# EAGLE schematic ManoMeter (EAGLE 7.7.0)
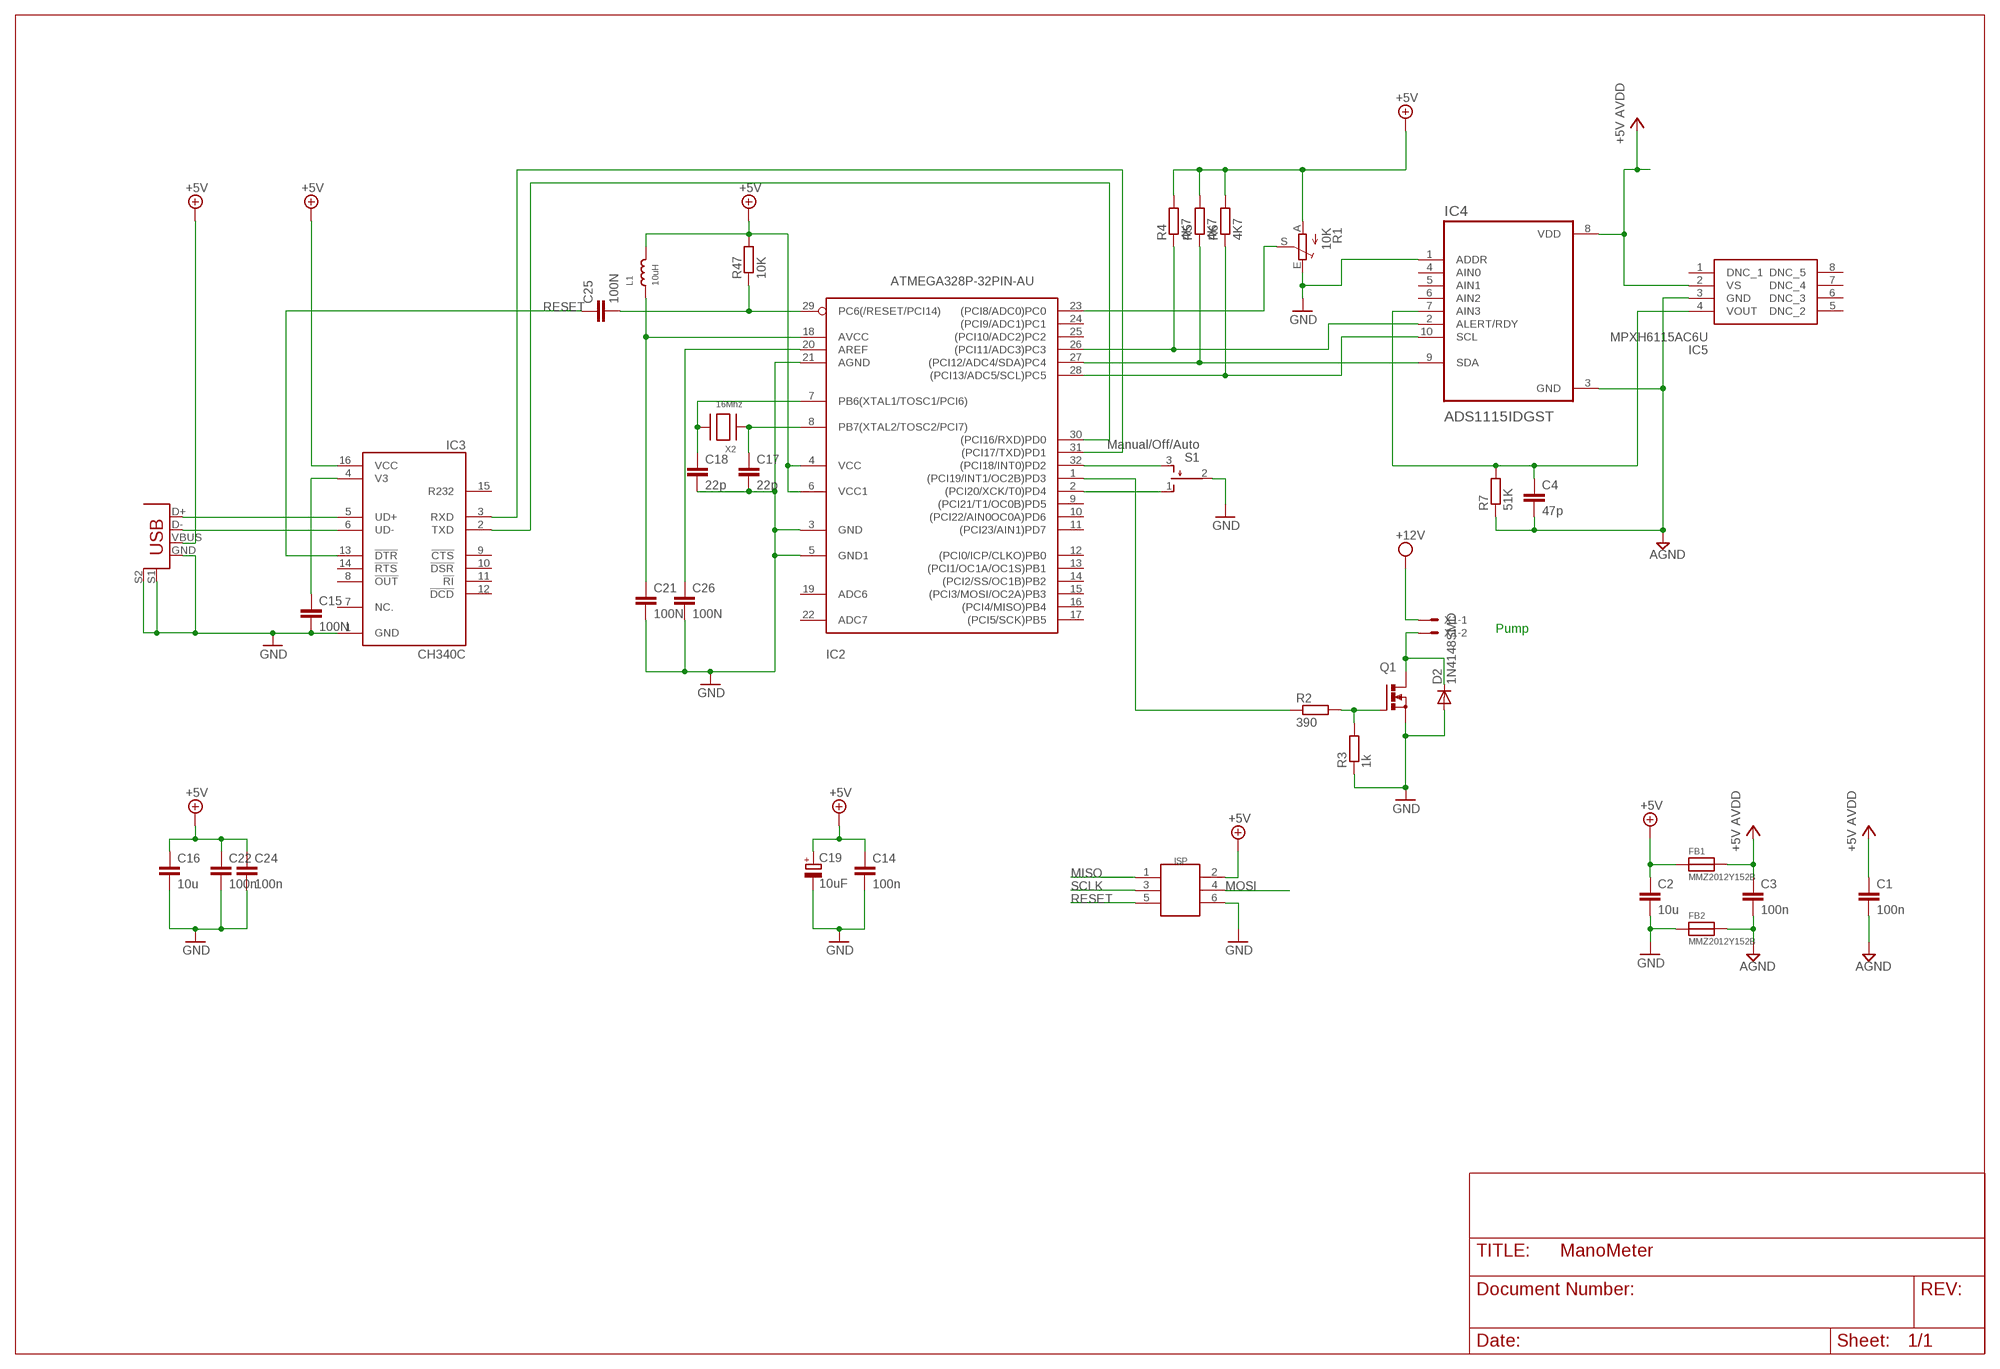
[diagram p0: schematic, sheet 1]

## Parts
C1  100n  C-EUC0805  [C0805]
C2  10u  C-EUC1210  [C1210]
C3  100n  C-EUC0805  [C0805]
C4  47p  C-EUC0805  [C0805]
C14  100n  C-EUC0805  [C0805]
C15  100N  C-EUC0805  [C0805]
C16  10u  C-EUC1210  [C1210]
C17  22p  C-EUC0805  [C0805]
C18  22p  C-EUC0805  [C0805]
C19  10uF  CPOL-EUR/2012-12R  [R/2012-12R]
C21  100N  C-EUC0805  [C0805]
C22  100n  C-EUC0805  [C0805]
C24  100n  C-EUC0805  [C0805]
C25  100N  C-EUC0805  [C0805]
C26  100N  C-EUC0805  [C0805]
D2  1N4148SMD  [M0805]
FB1  MMZ2012Y152B  FERRITE0805  [0805]
FB2  MMZ2012Y152B  FERRITE0805  [0805]
IC2  ATMEGA328P-32PIN-AU  [TQFP32-08]
IC3  CH340C  [SOIC127P600X180-16N]
IC4  ADS1115IDGST  [SOP50P490X110-10N]
IC5  MPXH6115AC6U  [MPXH6115AC6U]
ISP  HEADER-2X3P-SMD  [2X3P-2.54-SMD]
JP1  USB-B  USBPTH  [USB-B-PTH]
L1  10uH  INDUCTOR0805  [0805@1]
R1  10K  TRIM_EU-B25P  [B25P]
R2  390  R-EU_M0805  [M0805]
R3  1k  R-EU_M0805  [M0805]
R4  4K7  R-EU_M0805  [M0805]
R5  4K7  R-EU_M0805  [M0805]
R6  4K7  R-EU_M0805  [M0805]
R7  51K  R-EU_M0805  [M0805]
R47  10K  R-EU_M0805  [M0805]
S1  Manual/Off/Auto  TL38PO  [TL3XPO]
X1  22-23-2021  [22-23-2021]
X2  16Mhz  XTALNX5032  [NX5032]

## Nets
+5V [Vcc]: C1.2 C2.1 C3.2 C14.2 C16.1 C19.+ C22.2 C24.2 FB1.1 FB1.2 IC2.4(VCC) IC2.6(VCC1) IC3.16(VCC) IC4.8(VDD) IC5.2(VS) ISP.2 JP1.VBUS L1.2 R1.A R4.2 R5.2 R6.2 R47.2 ; supply symbol labelled +5V AVDD
AGND: C1.1 C3.1 C4.2 FB2.2 IC4.3(GND) IC5.3(GND) R7.1
GND: C2.2 C14.1 C15.2 C16.2 C17.2 C18.2 C19.- C21.2 C22.1 C24.1 C26.2 FB2.1 IC2.3(GND) IC2.5(GND1) IC2.21(AGND) IC3.1(GND) IC4.1(ADDR) ISP.6 JP1.GND JP1.S1(GND1) JP1.S2(GND2) R1.E R3.1 S1.2(P)
MISO: ISP.1
MOSI: ISP.4
N$1: IC2.32((PCI18/INT0)PD2) S1.3(S)
N$4: IC2.28((PCI13/ADC5/SCL)PC5) IC4.10(SCL) R6.1
N$5: C4.1 IC4.7(AIN3) IC5.4(VOUT) R7.2
N$6: IC2.27((PCI12/ADC4/SDA)PC4) IC4.9(SDA) R5.1
N$7: IC2.26((PCI11/ADC3)PC3) IC4.2(ALERT/RDY) R4.1
N$8: IC2.23((PCI8/ADC0)PC0) R1.S
N$9: IC2.1((PCI19/INT1/OC2B)PD3) R2.1
N$10: R2.2 R3.2
N$11: X1.2
N$12: IC2.2((PCI20/XCK/T0)PD4) S1.1(O)
N$21: IC3.6(UD-) JP1.D-
N$22: C15.1 IC3.4(V3)
N$32: C26.1 IC2.20(AREF)
N$33: C25.1 IC3.13(!DTR)
N$34: IC3.5(UD+) JP1.D+
N$36: IC2.31((PCI17/TXD)PD1) IC3.3(RXD)
N$40: C21.1 IC2.18(AVCC) L1.1
N$46: IC2.30((PCI16/RXD)PD0) IC3.2(TXD)
N$49: C18.1 IC2.7(PB6(XTAL1/TOSC1/PCI6)) X2.P$2
N$51: C17.1 IC2.8(PB7(XTAL2/TOSC2/PCI7)) X2.P$1
RESET: C25.2 IC2.29(PC6(/RESET/PCI14)) ISP.5 R47.1
SCLK: ISP.3
VCC: X1.1 ; supply symbol labelled +12V
Unconnected: D2.1(A) D2.2(C) IC2.9((PCI21/T1/OC0B)PD5) IC2.10((PCI22/AIN0OC0A)PD6) IC2.11((PCI23/AIN1)PD7) IC2.12((PCI0/ICP/CLKO)PB0) IC2.13((PCI1/OC1A/OC1S)PB1) IC2.14((PCI2/SS/OC1B)PB2) IC2.15((PCI3/MOSI/OC2A)PB3) IC2.16((PCI4/MISO)PB4) IC2.17((PCI5/SCK)PB5) IC2.19(ADC6) IC2.22(ADC7) IC2.24((PCI9/ADC1)PC1) IC2.25((PCI10/ADC2)PC2) IC3.7(NC.) IC3.8(!OUT) IC3.9(!CTS) IC3.10(!DSR) IC3.11(!RI) IC3.12(!DCD) IC3.14(!RTS) IC3.15(R232) IC4.4(AIN0) IC4.5(AIN1) IC4.6(AIN2) IC5.1(DNC_1) IC5.5(DNC_2) IC5.6(DNC_3) IC5.7(DNC_4) IC5.8(DNC_5)

## Notes on the sheet
- Pump

## Library data of the parts
C1 C3 C14 C15 C21 C22 C24-C26 = rcl:C-EU: CAPACITOR, European symbol
C2 C16 = rcl:C-EU: CAPACITOR, European symbol; FABRIKANTNO: GRM32ER61A106KA01L
C4 C17 C18 = rcl:C-EU: CAPACITOR, European symbol; FARNELL: 1759489
C19 = rcl:CPOL-EU: POLARIZED CAPACITOR, European symbol
D2 = Evert:1N4148: DIODE high speed (Philips)
FB1 FB2 = microbuilder:FERRITE: Ferrite Bead 0603 MMZ1608B121C - 120 Ohm, 600mA Ferrite Chip - Digikey: 445-2164-1-ND BK1608HW121-T - 120 Ohm, 600mA Ferrite Chip - Digikey: 587-1876-2-ND 0805 HZ0805B272R-10 - 2.7K Ohm @ 100MHz, 200mA 0.8 Ohm DC Resistance - Digikey: 240-2504-1-ND (see also Murata BLM21BD272SN1L)
IC2 = avr:ATMEGA328P-32PIN; FARNELL: 1972086
IC3 = CH340C:CH340C: USB to serial chip CH340 Check availability <https://pricing.snapeda.com/parts/CH340C/WCH/view-part?ref=eda>; AVAILABILITY: Not in stock; DESCRIPTION: USB to serial chip CH340; MF: WCH; MP: CH340C; PACKAGE: None; PRICE: None
IC4 = ADS1115IDGST:ADS1115IDGST: Check availability <https://pricing.snapeda.com/parts/ADS1115IDGST/Texas%20Instruments/view-part?ref=eda>; AVAILABILITY: In Stock; CHECK_PRICES: https://www.snapeda.com/parts/ADS1115IDGST/Texas+Instruments/view-part/?ref=eda; DESCRIPTION: 16-bit, 860-SPS, 4-channel, delta-sigma ADC with PGA, oscillator, VREF, comparator and I2C; MF: Texas Instruments; MP: ADS1115IDGST; PACKAGE: VSSOP-10 Texas Instruments; PRICE: None; PURCHASE-URL: https://www.snapeda.com/api/url_track_click_mouser/?unipart_id=45901&manufacturer=Texas Instruments&part_name=ADS1115IDGST&search_term=ads1115; SNAPEDA_LINK: https://www.snapeda.com/parts/ADS1115IDGST/Texas+Instruments/view-part/?ref=snap
IC5 = MPXH6115AC6U:MPXH6115AC6U: Board Mount Pressure Sensors 16.7psi 115kPA Pressure Sensor Source: Datasheet <http://www.nxp.com/docs/en/data-sheet/MPXA6115A.pdf>; DESCRIPTION: Board Mount Pressure Sensors 16.7psi 115kPA Pressure Sensor; HEIGHT: 9.906mm; MANUFACTURER_NAME: NXP; MANUFACTURER_PART_NUMBER: MPXH6115AC6U
ISP = HR911105:HEADER-2X3P; FARNELL: 9689567
JP1 = SparkFun-Connectors:USB: USB Connectors USB-B-PTH is fully proven SKU : PRT-00139/CONN-08278 USB-miniB is fully proven SKU : PRT-00587 USB-A-PCB is untested. USB-A-H is throughly reviewed, but untested. Spark Fun Electronics SKU : PRT-00437 USB-B-SMT is throughly reviewed, but untested. Needs silkscreen touching up. USB-A-S has not been used/tested USB-MB-H has not been used/tested USB-MICROB has been used. CONN-09505; PROD_ID: CONN-08278
L1 = microbuilder:INDUCTOR: Inductors 0603: 10nH Ceramic Inductor - microwire antenna/RF (Digikey: 712-1434-2-ND) 0805: 560nH Ceramic Inductor - RF (Digikey: 553-1047-1-ND) 270nH Ceramic Inductor - Q = 40@250MHz, +-5%, 1 Ohm DC Resistance (Digikey: 535-10506-2-ND) 1007 (2518 Metric) SMT: 10µH 10% 250mOhm 820mA 1007 Inductor (Digikey: 587-2189-1-ND) 22µH 10% 500mOhm 580mA 1007 Inductor (Digikey: 587-2190-1-ND) 47µH 10% 950mOhm 420mA 1007 Inductor (Digikey: 587-2191-1-ND) 47µH 5% 100mOhm 1A 1008 Inductor (Digikey: 732-1816-1-ND) 5.0x5.0mm (Taiyo Yuden NR5040 Series) 6.8µH 20% 2.3A 64mOhm Inductor (Digikey: 587-2374-2-ND) 5.0x5.0mm (TDK VLC5045 Series) 4.7µH 20% 3.3A 34mOhm Inductor (Digikey: 445-6526-1-ND) 6.8µH 20% 2.7A 46mOhm Inductor (Digikey: 445-6527-1-ND) 6.0x6.0mm (TDK VLC6045 Series) 4.7µH 20% 3.8A 27mOhm Inductor (Digikey: 445-6538-2-ND) 6.8µH 20% 3A 41mOhm Inductor (Digikey: 445-6540-1-ND) 6.2µH 30% 2.2A 45mOhm Inductor (Digikey: SRR5028-6R2YCT-ND) - Not TDK VLC6045 but footprint should match 6.0x6.0mm (TDK SLF6045 Series) 6.8uH 30% 2A 33mOhm Inductor (Digikey: 445-4572-1-ND, Mouser: 810-SLF645T6R8N2R0PF); FARNELL: 2215650
R1 = pot:TRIM_EU-: POTENTIOMETER
R2-R7 R47 = rcl:R-EU_: RESISTOR, European symbol
S1 = switch:TL38PO: TINY SWITCH ON OFF MOM Source: http://www2.produktinfo.conrad.com/datenblaetter/700000-724999/705152-da-01-de-Subminiaturschalter_TL_36YO.pdf
X1 = con-molex:22-23-2021: .100" (2.54mm) Center Header - 2 Pin; MF: MOLEX; MPN: 22-23-2021; OC_FARNELL: 1462926; OC_NEWARK: 25C3832
X2 = adafruit:XTAL: Low cost SMT crystals, no capacitors included http://www.ladyada.net/library/eagle; FARNELL: 2467791

## Net classes
2 Vcc: width 0.356 mm, clearance 0.203 mm
3 Gnd: width 0.356 mm
5 Highcurrent: width 0.356 mm